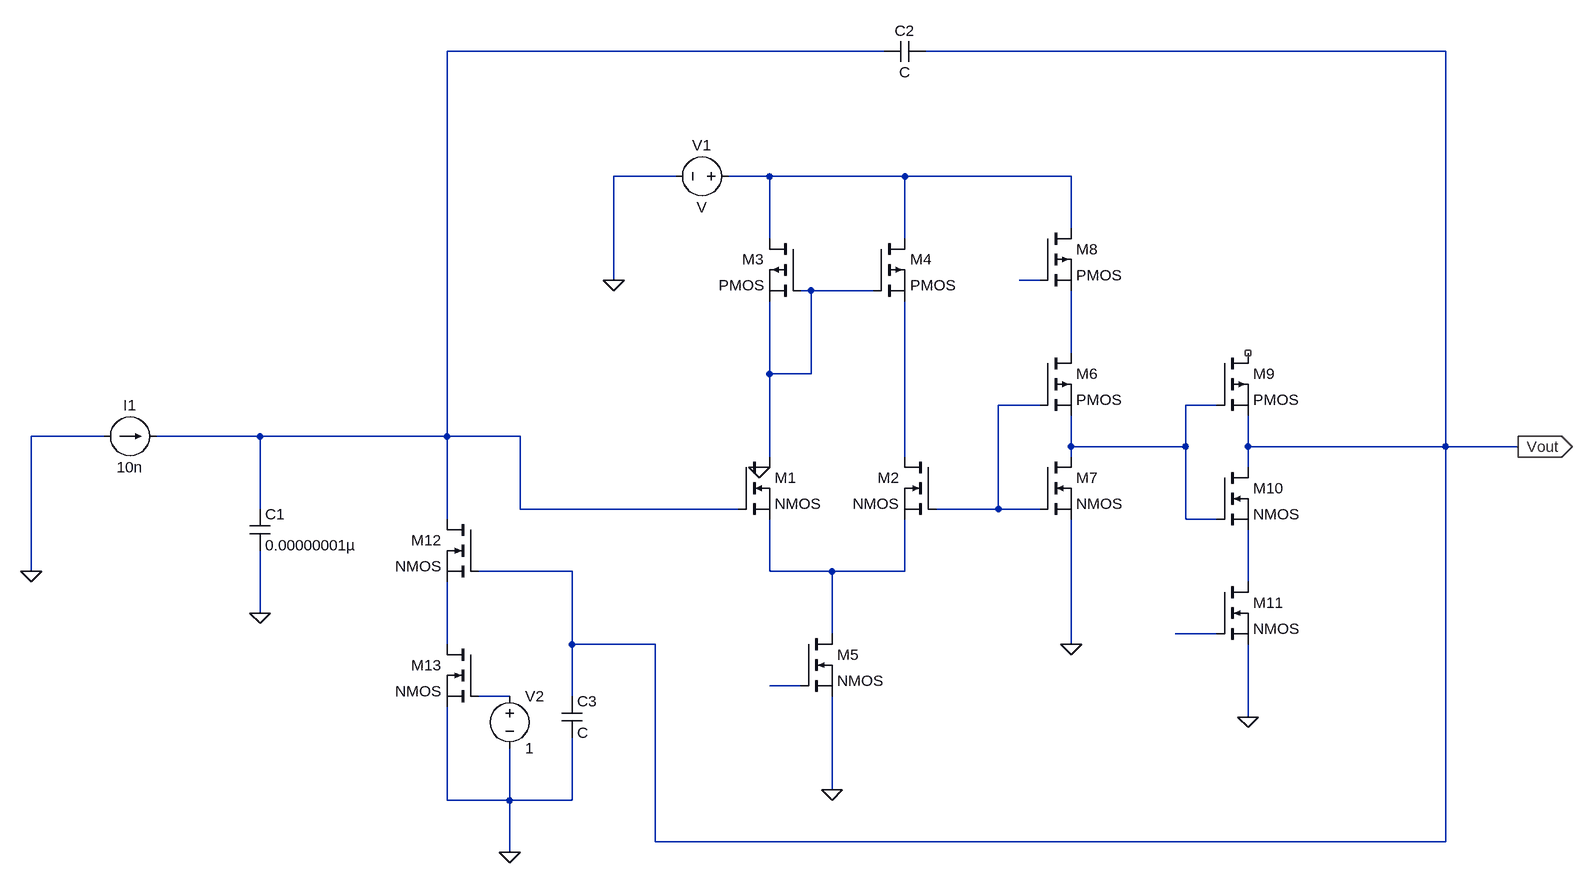
[diagram p0: schematic Draft4.asc]
Draft4.asc, the LTspice schematic file:
Version 4
SHEET 1 1568 804
WIRE 480 -448 -192 -448
WIRE 1344 -448 544 -448
WIRE 160 -256 64 -256
WIRE 304 -256 240 -256
WIRE 512 -256 304 -256
WIRE 768 -256 512 -256
WIRE 768 -176 768 -256
WIRE 304 -160 304 -256
WIRE 512 -160 512 -256
WIRE 64 -96 64 -256
WIRE 720 -96 688 -96
WIRE 368 -80 352 -80
WIRE 464 -80 368 -80
WIRE 768 16 768 -80
WIRE 304 48 304 -64
WIRE 368 48 368 -80
WIRE 368 48 304 48
WIRE 720 96 656 96
WIRE 992 96 944 96
WIRE -720 144 -832 144
WIRE -480 144 -640 144
WIRE -192 144 -192 -448
WIRE -192 144 -480 144
WIRE -80 144 -192 144
WIRE 768 160 768 112
WIRE 944 160 944 96
WIRE 944 160 768 160
WIRE 1040 160 1040 112
WIRE 1344 160 1344 -448
WIRE 1344 160 1040 160
WIRE 1456 160 1344 160
WIRE 304 176 304 48
WIRE 512 176 512 -64
WIRE 768 176 768 160
WIRE 1040 192 1040 160
WIRE -480 256 -480 144
WIRE -80 256 -80 144
WIRE 256 256 -80 256
WIRE 656 256 656 96
WIRE 656 256 560 256
WIRE 720 256 656 256
WIRE -192 272 -192 144
WIRE 944 272 944 160
WIRE 992 272 944 272
WIRE -832 352 -832 144
WIRE 0 352 -144 352
WIRE 304 352 304 272
WIRE 400 352 304 352
WIRE 512 352 512 272
WIRE 512 352 400 352
WIRE 1040 368 1040 288
WIRE -480 416 -480 320
WIRE 400 448 400 352
WIRE 992 448 928 448
WIRE -192 464 -192 368
WIRE 0 464 0 352
WIRE 128 464 0 464
WIRE 768 464 768 272
WIRE 352 528 304 528
WIRE -96 544 -144 544
WIRE 0 544 0 464
WIRE 1040 576 1040 464
WIRE 400 688 400 544
WIRE -192 704 -192 560
WIRE -96 704 -96 624
WIRE -96 704 -192 704
WIRE 0 704 0 608
WIRE 0 704 -96 704
WIRE 128 768 128 464
WIRE 1344 768 1344 160
WIRE 1344 768 128 768
WIRE -96 784 -96 704
FLAG 400 688 0
FLAG -480 416 0
FLAG 768 464 0
FLAG 1040 576 0
FLAG 64 -96 0
FLAG 1456 160 Vout
IOPIN 1456 160 Out
FLAG -832 352 0
FLAG 288 192 0
FLAG -96 784 0
SYMBOL nmos 256 176 R0
SYMATTR InstName M1
SYMBOL nmos 560 176 M0
SYMATTR InstName M2
SYMBOL pmos 352 -160 M0
SYMATTR InstName M3
SYMBOL pmos 464 -160 R0
SYMATTR InstName M4
SYMBOL nmos 352 448 R0
SYMATTR InstName M5
SYMBOL cap -496 256 R0
SYMATTR InstName C1
SYMATTR Value 0.00000001µ
SYMBOL pmos 720 16 R0
SYMATTR InstName M6
SYMBOL nmos 720 176 R0
SYMATTR InstName M7
SYMBOL pmos 720 -176 R0
SYMATTR InstName M8
SYMBOL pmos 992 16 R0
SYMATTR InstName M9
SYMBOL nmos 992 192 R0
SYMATTR InstName M10
SYMBOL nmos 992 368 R0
SYMATTR InstName M11
SYMBOL cap 544 -464 R90
WINDOW 0 0 32 VBottom 2
WINDOW 3 32 32 VTop 2
SYMATTR InstName C2
SYMBOL nmos -144 272 M0
SYMATTR InstName M12
SYMBOL nmos -144 464 M0
SYMATTR InstName M13
SYMBOL cap -16 544 R0
SYMATTR InstName C3
SYMBOL voltage 256 -256 R90
WINDOW 0 -32 56 VBottom 2
WINDOW 3 32 56 VTop 2
SYMATTR InstName V1
SYMBOL current -720 144 R270
WINDOW 0 32 40 VTop 2
WINDOW 3 -32 40 VBottom 2
WINDOW 123 0 0 Left 0
WINDOW 39 0 0 Left 0
SYMATTR InstName I1
SYMATTR Value 10n
SYMBOL voltage -96 528 R0
WINDOW 123 0 0 Left 0
WINDOW 39 0 0 Left 0
SYMATTR InstName V2
SYMATTR Value 1

The netlist it stands for:
* Draft4.asc
M1 N004 N001 N009 N009 NMOS
M2 N008 N006 N009 N009 NMOS
M3 N002 N004 N004 N004 PMOS
M4 N002 N004 N008 N008 PMOS
M5 N009 N013 0 0 NMOS
C1 N001 0 0.00000001µ
M6 N005 N006 N007 N007 PMOS
M7 N007 N006 0 0 NMOS
M8 N002 N003 N005 N005 PMOS
M9 NC_01 N007 Vout Vout PMOS
M10 Vout N007 N010 N010 NMOS
M11 N010 N011 0 0 NMOS
C2 Vout N001 C
M12 N001 Vout N012 N012 NMOS
M13 N012 N014 0 0 NMOS
C3 Vout 0 C
V1 N002 0 V
I1 0 N001 10n
V2 N014 0 1
.model NMOS NMOS
.model PMOS PMOS
.lib standard.mos
.backanno
.end